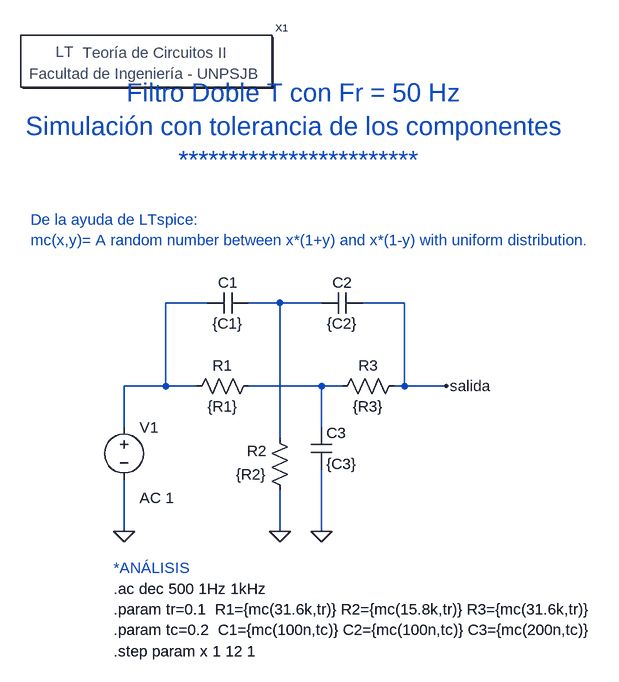
[diagram p0: schematic Analisis de Montecarlo del filtro doble t ranura pasivo.asc]
Analisis de Montecarlo del filtro doble t ranura pasivo.asc, the LTspice schematic file:
Version 4
SHEET 1 880 680
WIRE 96 80 32 80
WIRE 208 80 160 80
WIRE 272 80 208 80
WIRE 400 80 336 80
WIRE 32 208 32 80
WIRE 32 208 -32 208
WIRE 80 208 32 208
WIRE 272 208 160 208
WIRE 304 208 272 208
WIRE 400 208 400 80
WIRE 400 208 384 208
WIRE 464 208 400 208
WIRE -32 272 -32 208
WIRE 272 272 272 208
WIRE 208 288 208 80
WIRE -32 432 -32 352
WIRE 208 432 208 368
WIRE 272 432 272 336
FLAG 208 432 0
FLAG 272 432 0
FLAG 464 208 salida
FLAG -32 432 0
SYMBOL cap 160 64 R90
WINDOW 0 0 32 VBottom 2
WINDOW 3 32 32 VTop 2
SYMATTR InstName C1
SYMATTR Value {C1}
SYMBOL cap 336 64 R90
WINDOW 0 0 32 VBottom 2
WINDOW 3 32 32 VTop 2
SYMATTR InstName C2
SYMATTR Value {C2}
SYMBOL res 176 192 R90
WINDOW 0 0 56 VBottom 2
WINDOW 3 32 56 VTop 2
SYMATTR InstName R1
SYMATTR Value {R1}
SYMBOL res 224 384 R180
WINDOW 0 36 76 Left 2
WINDOW 3 36 40 Left 2
SYMATTR InstName R2
SYMATTR Value {R2}
SYMBOL cap 256 272 R0
SYMATTR InstName C3
SYMATTR Value {C3}
SYMBOL res 400 192 R90
WINDOW 0 0 56 VBottom 2
WINDOW 3 32 56 VTop 2
SYMATTR InstName R3
SYMATTR Value {R3}
SYMBOL voltage -32 256 R0
WINDOW 123 24 124 Left 2
WINDOW 39 0 0 Left 2
SYMATTR Value2 AC 1
SYMATTR InstName V1
SYMATTR Value ""
SYMBOL Circuitos2\\Letreros\\Teoría\ de\ Circuitos\ II 0 -288 R0
SYMATTR InstName X1
TEXT -48 520 Left 2 !.ac dec 500 1Hz 1kHz
TEXT -48 488 Left 2 ;*ANÁLISIS
TEXT 232 -192 Center 4 ;Filtro Doble T con Fr = 50 Hz\nSimulación con tolerancia de los componentes\n************************
TEXT -48 552 Left 2 !.param tr=0.1  R1={mc(31.6k,tr)} R2={mc(15.8k,tr)} R3={mc(31.6k,tr)}\n.param tc=0.2  C1={mc(100n,tc)} C2={mc(100n,tc)} C3={mc(200n,tc)}
TEXT -48 616 Left 2 !.step param x 1 12 1
TEXT -176 -48 Left 2 ;De la ayuda de LTspice:\nmc(x,y)= A random number between x*(1+y) and x*(1-y) with uniform distribution.

The netlist it stands for:
* Analisis de Montecarlo del filtro doble t ranura pasivo.asc
C1 N002 N001 {C1}
C2 salida N002 {C2}
R1 N003 N001 {R1}
R2 0 N002 {R2}
C3 N003 0 {C3}
R3 salida N003 {R3}
V1 N001 0 AC 1
XX1 Teoría de Circuitos II
.ac dec 500 1Hz 1kHz
* *ANÁLISIS
* Filtro Doble T con Fr = 50 Hz
* Simulación con tolerancia de los componentes
* ************************
.param tr=0.1  R1={mc(31.6k,tr)} R2={mc(15.8k,tr)} R3={mc(31.6k,tr)}
.param tc=0.2  C1={mc(100n,tc)} C2={mc(100n,tc)} C3={mc(200n,tc)}
.step param x 1 12 1
* De la ayuda de LTspice:
* mc(x,y)= A random number between x*(1+y) and x*(1-y) with uniform distribution.
.backanno
.end